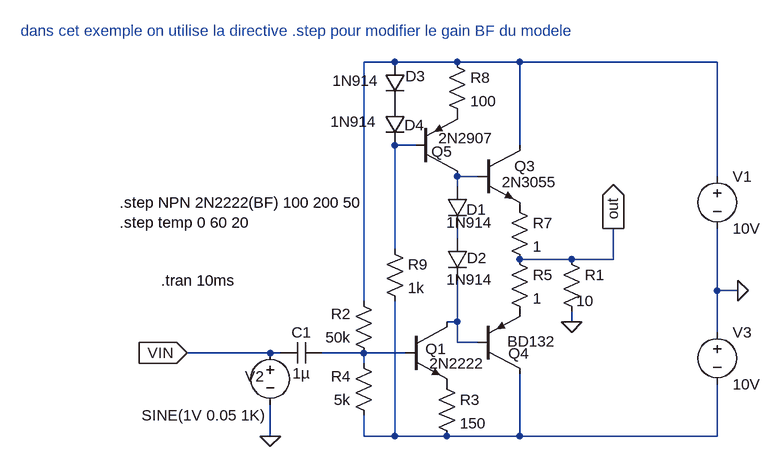
[diagram p0: schematic npn_emetteur_collecteur_mieux.asc]
npn_emetteur_collecteur_mieux.asc, the LTspice schematic file:
Version 4
SHEET 1 880 680
WIRE 128 48 80 48
WIRE 224 48 128 48
WIRE 320 48 224 48
WIRE 624 48 320 48
WIRE 160 176 128 176
WIRE 320 176 320 48
WIRE 256 224 224 224
WIRE 624 224 624 48
WIRE 224 240 224 224
WIRE 224 320 224 304
WIRE 128 336 128 176
WIRE 400 352 320 352
WIRE 464 352 464 304
WIRE 464 352 400 352
WIRE 624 400 624 304
WIRE 656 400 624 400
WIRE 80 416 80 48
WIRE 224 448 224 384
WIRE 224 448 208 448
WIRE 400 448 400 432
WIRE 624 464 624 400
WIRE 224 480 224 448
WIRE 256 480 224 480
WIRE -64 496 -192 496
WIRE -48 496 -64 496
WIRE 80 496 16 496
WIRE 144 496 80 496
WIRE 80 512 80 496
WIRE -64 624 -64 576
WIRE 80 624 80 592
WIRE 128 624 128 416
WIRE 128 624 80 624
WIRE 208 624 128 624
WIRE 320 624 320 528
WIRE 320 624 208 624
WIRE 624 624 624 544
WIRE 624 624 320 624
FLAG 656 400 0
FLAG -192 496 VIN
IOPIN -192 496 In
FLAG 464 304 out
IOPIN 464 304 Out
FLAG 400 448 0
FLAG -64 624 0
SYMBOL npn 144 448 R0
WINDOW 0 31 42 Left 0
WINDOW 3 37 64 Left 0
SYMATTR InstName Q1
SYMATTR Value 2N2222
SYMBOL voltage 624 208 R0
WINDOW 123 0 0 Left 0
WINDOW 39 0 0 Left 0
SYMATTR InstName V1
SYMATTR Value 10V
SYMBOL voltage -64 480 R0
WINDOW 3 -198 112 Left 0
WINDOW 123 0 0 Left 0
WINDOW 39 0 0 Left 0
WINDOW 0 -39 52 Left 0
SYMATTR Value SINE(1V 0.05 1K)
SYMATTR InstName V2
SYMBOL res 96 512 R180
WINDOW 0 36 76 Left 0
WINDOW 3 36 40 Left 0
SYMATTR InstName R2
SYMATTR Value 50k
SYMBOL res 96 608 R180
WINDOW 0 36 76 Left 0
WINDOW 3 36 40 Left 0
SYMATTR InstName R4
SYMATTR Value 5k
SYMBOL cap 16 480 R90
WINDOW 0 0 32 VBottom 0
WINDOW 3 32 32 VTop 0
SYMATTR InstName C1
SYMATTR Value 1µ
SYMBOL npn 256 176 R0
WINDOW 3 37 57 Left 0
SYMATTR InstName Q3
SYMATTR Value 2N3055
SYMBOL pnp 256 528 M180
WINDOW 0 47 31 Left 0
WINDOW 3 45 50 Left 0
SYMATTR InstName Q4
SYMATTR Value BD132
SYMBOL res 304 336 R0
SYMATTR InstName R5
SYMATTR Value 1
SYMBOL res 304 256 R0
SYMATTR InstName R7
SYMATTR Value 1
SYMBOL voltage 624 448 R0
WINDOW 123 0 0 Left 0
WINDOW 39 0 0 Left 0
SYMATTR InstName V3
SYMATTR Value 10V
SYMBOL diode 208 240 R0
WINDOW 0 30 35 Left 0
WINDOW 3 -1 55 Left 0
SYMATTR InstName D1
SYMATTR Value 1N914
SYMBOL pnp 160 224 M180
WINDOW 0 24 38 Left 0
WINDOW 3 35 59 Left 0
SYMATTR InstName Q5
SYMATTR Value 2N2907
SYMBOL res 208 32 R0
SYMATTR InstName R8
SYMATTR Value 100
SYMBOL diode 112 48 R0
WINDOW 0 32 22 Left 0
WINDOW 3 -80 29 Left 0
SYMATTR InstName D3
SYMATTR Value 1N914
SYMBOL diode 112 112 R0
WINDOW 0 31 33 Left 0
WINDOW 3 -83 28 Left 0
SYMATTR InstName D4
SYMATTR Value 1N914
SYMBOL res 112 320 R0
SYMATTR InstName R9
SYMATTR Value 1k
SYMBOL res 384 336 R0
WINDOW 3 23 80 Left 0
SYMATTR InstName R1
SYMATTR Value 10
SYMBOL diode 208 320 R0
WINDOW 0 31 30 Left 0
WINDOW 3 -1 63 Left 0
SYMATTR InstName D2
SYMATTR Value 1N914
SYMBOL res 192 528 R0
SYMATTR InstName R3
SYMATTR Value 150
TEXT -232 384 Left 0 !.tran 10ms
TEXT -296 264 Left 0 !.step NPN 2N2222(BF) 100 200 50\n.step temp 0 60 20
TEXT -448 0 Left 0 ;dans cet exemple on utilise la directive .step pour modifier le gain BF du modele

The netlist it stands for:
* npn_emetteur_collecteur_mieux.asc
Q1 N005 N006 P001 0 2N2222
V1 N001 0 10V
V2 VIN 0 SINE(1V 0.05 1K)
R2 N006 N001 50k
R4 N007 N006 5k
C1 N006 VIN 1µ
Q3 N001 N003 P002 0 2N3055
Q4 N007 N005 P003 0 BD132
R5 out P003 1
R7 P002 out 1
V3 0 N007 10V
D1 N003 N004 1N914
Q5 N003 N002 P004 0 2N2907
R8 N001 P004 100
D3 N001 P005 1N914
D4 P005 N002 1N914
R9 N002 N007 1k
R1 out 0 10
D2 N004 N005 1N914
R3 P001 N007 150
.model D D
.lib standard.dio
.model NPN NPN
.model PNP PNP
.lib standard.bjt
.tran 10ms
.step NPN 2N2222(BF) 100 200 50
.step temp 0 60 20
* dans cet exemple on utilise la directive .step pour modifier le gain BF du modele
.backanno
.end